# Altium schematic sheet ip_phone_g_codec.SchDoc: CODEC
size A3; Organization: Instituto Atlântico; Address1: Rua Chico Lemos, 946; Address2: Cidade dos Funcionários; Address3: CEP: 60822-780; Address4: Fortaleza - CE
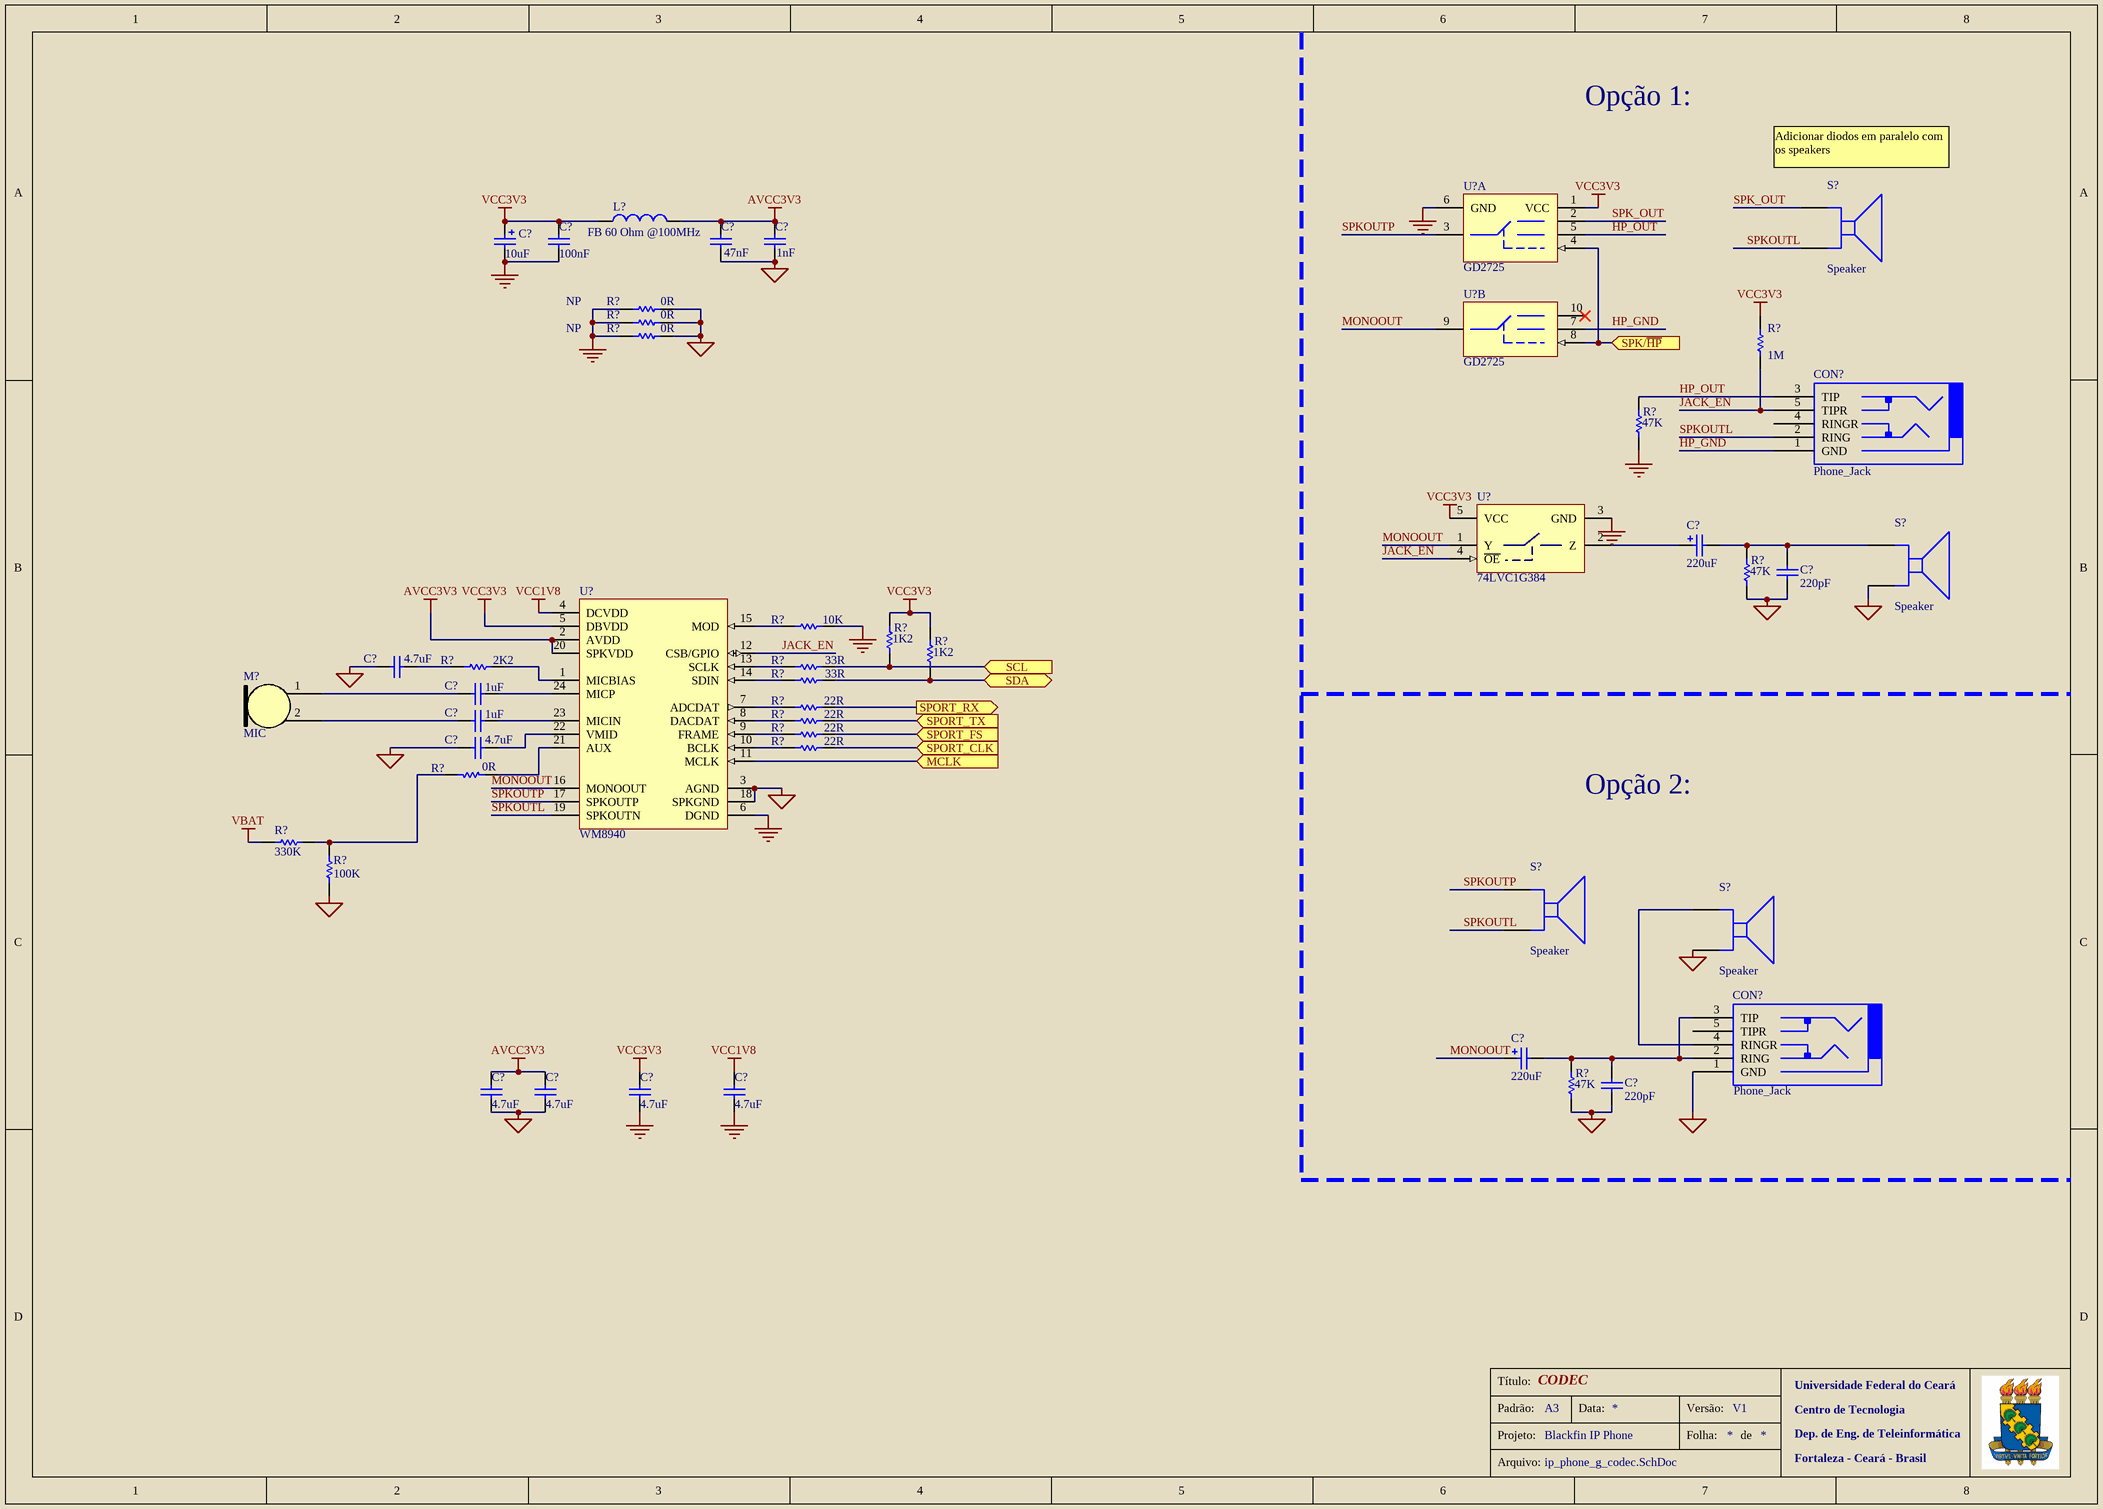
[diagram p0: ip_phone_g_codec.SchDoc]

## Parts
(Parts that share a designator on the sheet are numbered #1, #2 ... from top to bottom, then left to right.)
C?#1  10uF  [VE-100M0JTR-0305]
C?#2  100nF  [CC1005-0402]
C?#3  47nF  [CC1005-0402]
C?#4  1nF  [CC1005-0402]
C?#5  220uF
C?#6  220pF  [CC1005-0402]
C?#7  4.7uF  [CC1608-0603]
C?#8  1uF  [CC1005-0402]
C?#9  1uF  [CC1005-0402]
C?#10  4.7uF
C?#11  220uF
C?#12  220pF  [CC1005-0402]
C?#13  4.7uF  [CC1608-0603]
C?#14  4.7uF  [CC1608-0603]
C?#15  4.7uF  [CC1608-0603]
C?#16  4.7uF  [CC1608-0603]
CON?#1  Phone_Jack  [Phone_Jack]
CON?#2  Phone_Jack  [Phone_Jack]
L?  FB 60 Ohm @100MHz  [INDUTOR_0603]
M?  MIC  [MIC]
R?#1  0R  [CR1608-0603]
R?#2  1M  [CR1005-0402]
R?#3  0R  [CR1608-0603]
R?#4  0R  [CR1608-0603]
R?#5  47K  [CR1005-0402]
R?#6  47K  [CR1005-0402]
R?#7  1K2  [CR1005-0402]
R?#8  10K  [CR1005-0402]
R?#9  1K2  [CR1005-0402]
R?#10  2K2  [CR1005-0402]
R?#11  33R  [CR1005-0402]
R?#12  33R  [CR1005-0402]
R?#13  22R  [CR1005-0402]
R?#14  22R  [CR1005-0402]
R?#15  22R  [CR1005-0402]
R?#16  22R  [CR1005-0402]
R?#17  0R  [CR1005-0402]
R?#18  330K  [CR1005-0402]
R?#19  100K  [CR1005-0402]
R?#20  47K  [CR1005-0402]
S?#1  Speaker  [Speaker]
S?#2  Speaker  [Speaker]
S?#3  Speaker  [Speaker]
S?#4  Speaker  [Speaker]
U?#1  GD2725  [QFN10]  (part A of 2)
U?#2  GD2725  [QFN10]  (part B of 2)
U?#3  74LVC1G384  [SOT753]
U?#4  WM8940  [QFN24]

## Ports
MCLK (in), SCL (in), SDA (bidir), SPK/~{HP} (in), SPORT_CLK (in), SPORT_FS (in), SPORT_RX (out), SPORT_TX (in)

## Nets
AGND: C?#3.1 C?#4.1 C?#6.1 C?#7.2 C?#10.2 C?#12.1 C?#13.1 C?#14.1 CON?#2.1(GND) R?#1.1 R?#3.1 R?#4.1 R?#6.2 R?#19.1 R?#20.2 S?#2.1(CKT1) S?#4.1(CKT1) U?#4.3(AGND) U?#4.18(SPKGND)
AVCC3V3: C?#3.2 C?#4.2 C?#13.2 C?#14.2 L?.2 U?#4.2(AVDD) U?#4.20(SPKVDD)
GND: C?#1.2 C?#2.1 C?#15.1 C?#16.1 R?#1.2 R?#3.2 R?#4.2 R?#5.2 R?#8.2 U?#1.6(GND) U?#3.3(GND) U?#4.6(DGND)
VBAT: R?#18.1
VCC1V8: C?#16.2 U?#4.4(DCVDD)
VCC3V3: C?#1.1 C?#2.2 C?#15.2 L?.1 R?#2.1 R?#7.1 R?#9.1 U?#1.1(VCC) U?#3.5(VCC) U?#4.5(DBVDD)
HP_GND: CON?#1.1(GND) U?#2.7(NC2)
HP_OUT: CON?#1.3(TIP) R?#5.1 U?#1.5(NC1)
JACK_EN: CON?#1.5(TIPR) R?#2.2 U?#3.4(~{OE}) U?#4.12(CSB/GPIO)
MCLK: U?#4.11(MCLK) ; port MCLK
MONOOUT: C?#11.1 U?#2.9(COM2) U?#3.1(Y) U?#4.16(MONOOUT)
SCL: R?#7.2 R?#11.2 ; port SCL
SDA: R?#9.2 R?#12.2 ; port SDA
SPK/~{HP}: U?#1.4(IN1) U?#2.8(IN2) ; port SPK/~{HP}
SPK_OUT: S?#1.2(CKT2) U?#1.2(NO1)
SPKOUTL: CON?#1.2(RING) S?#1.1(CKT1) S?#3.1(CKT1) U?#4.19(SPKOUTN)
SPKOUTP: S?#3.2(CKT2) U?#1.3(COM1) U?#4.17(SPKOUTP)
SPORT_CLK: R?#16.2 ; port SPORT_CLK
SPORT_FS: R?#15.2 ; port SPORT_FS
SPORT_RX: R?#13.2 ; port SPORT_RX
SPORT_TX: R?#14.2 ; port SPORT_TX
NetC?#5_1: C?#5.1 U?#3.2(Z)
NetC?#5_2: C?#5.2 C?#6.2 R?#6.1 S?#2.2(CKT2)
NetC?#7_1: C?#7.1 R?#10.1
NetC?#8_1: C?#8.1 U?#4.24(MICP)
NetC?#8_2: C?#8.2 M?.1(OUT)
NetC?#9_1: C?#9.1 U?#4.23(MICIN)
NetC?#9_2: C?#9.2 M?.2(GND)
NetC?#10_1: C?#10.1 U?#4.22(VMID)
NetC?#11_2: C?#11.2 C?#12.2 CON?#2.2(RING) CON?#2.3(TIP) R?#20.1
NetCON?#2_4: CON?#2.4(RINGR) S?#4.2(CKT2)
NetR?#8_1: R?#8.1 U?#4.15(MOD)
NetR?#10_2: R?#10.2 U?#4.1(MICBIAS)
NetR?#11_1: R?#11.1 U?#4.13(SCLK)
NetR?#12_1: R?#12.1 U?#4.14(SDIN)
NetR?#13_1: R?#13.1 U?#4.7(ADCDAT)
NetR?#14_1: R?#14.1 U?#4.8(DACDAT)
NetR?#15_1: R?#15.1 U?#4.9(FRAME)
NetR?#16_1: R?#16.1 U?#4.10(BCLK)
NetR?#17_1: R?#17.1 U?#4.21(AUX)
NetR?#17_2: R?#17.2 R?#18.2 R?#19.2

Not connected (* = marked no-connect by the designer): CON?#1 4(RINGR); CON?#2 5(TIPR); U?#2 10(NO2)*

## Notes on the sheet
- Opção 1:
- (near S?#1) Adicionar diodos em paralelo com os speakers
- Opção 2:
- Título:
- Universidade Federal do Ceará
- Padrão:
- Projeto:
- A3
- Blackfin IP Phone
- Data:
- Versão:
- Folha:
- V1
- de
- Centro de Tecnologia
- Dep. de Eng. de Teleinformática
- Fortaleza - Ceará - Brasil
- Arquivo:

## Library data of the parts
C?#1 = Capacitor_Electrolytic: Aluminum Electrolytic Capacitors - SMD 6.3 Volts 10uF 20%; eVendorPart#: 140-VE100M0JTR0305; Manufacturer: Lelon; eVendor: Mouser; MSRP: 0,099; eVendorPrice: 0,18; Part#: VE-100M0JTR-0305; MOQ: 1000
C?#2 = Capacitor: MLCC - SMD/SMT 100nF 16V 10% 0402; eVendorPart#: 810-C1005X7R1C104K; Manufacturer: TDK; Part#: C1005X7R1C104KT; eVendor: Mouser; eVendorPrice: 0,03; MSRP: 0,005; MOQ: 1000
C?#3 = Capacitor: MLCC - SMD/SMT 47nF 16V 10% 0402; eVendorPart#: 311-1334-1-ND; Manufacturer: Yageo; Part#: CC0402KRX7R6BB473; eVendor: Digikey; eVendorPrice: 0,02; MSRP: 0,00429; MOQ: 1000
C?#4 = Capacitor: MLCC - SMD/SMT 1nF 16V 10% 0402; eVendorPart#: 311-1352-1-ND; Manufacturer: Yageo; Part#: CC0402KRX7R7BB102; eVendor: Digikey; eVendorPrice: 0,015; MSRP: 0,00335; MOQ: 1000
C?#5 C?#11 = Capacitor_Electrolytic: Aluminum Electrolytic Capacitors - SMD 6.3 Volts 220uF 20%; eVendorPart#: 140-VE221M0JTR0605; Part#: VE-221M0JTR-0605; Manufacturer: Lelon; eVendor: Mouser; MSRP: 0,07; eVendorPrice: 0,16; MOQ: 1000
C?#6 C?#12 = Capacitor: Capacitor 220pF 0402; eVendorPart#: 311-1035-1-ND; Manufacturer: Yageo; Part#: CC0402KRX7R9BB221; eVendor: Digikey; eVendorPrice: 0,015; MSRP: 0,00335; MOQ: 1000
C?#7 C?#10 C?#13-C?#16 = Capacitor: MLCC - SMD/SMT 4.7uF 6.3V 10% 0603; eVendorPart#: 810-C1608X5R0J475K; Manufacturer: TDK; Part#: C1608X5R0J475KT; eVendor: Mouser; eVendorPrice: 0,09; MSRP: 0,031; MOQ: 1000
C?#8 C?#9 = Capacitor: CAP CER 1.0UF 6.3V 20% X5R 0402; eVendorPart#: 490-1319-1-ND; Manufacturer: Murata Electronics North America; Part#: GRM155R60J105ME19D; eVendor: Digikey; eVendorPrice: 0,055; MSRP: 0,01193; MOQ: 1000
CON?#1 CON?#2 = Phone_Jack: CONN JACK STEREO 5PIN 2.5MM SMD; eVendorPart#: CP1-2535SJCT-ND; Manufacturer: CUI Inc; Part#: SJ1-2535-SMT; eVendorPrice: 1,51; eVendor: Digikey; MSRP: 0,71676; MOQ: 500
L? = Inductor: Ferrite Bead 60 Ohm @100MHz; eVendorPart#: 667-EXC-3BP600H; Manufacturer: Panasonic Electronic Components; Part#: EXC-3BP600H; eVendor: Mouser; eVendorPrice: 0,11; MSRP: 0,066; MOQ: 1000
M? = MIC: Microphones -44DB 2VDC .5MA 2.2KOHM; Part#: POW-1644P-B-R; Manufacturer: PUI Audio; eVendorPart#: 665-POW1644PBR; eVendor: Mouser; eVendorPrice: 2,95; MSRP: 2,24; MOQ: 100
R?#1 R?#3 R?#4 = Resistor: Thick Film Resistors ZERO OHM; eVendorPart#: 652-CR0603-J/-000ELF; Manufacturer: Bourns; Part#: CR0603-J/-000ELF; eVendor: Mouser; eVendorPrice: 0,02; MSRP: 0,008; MOQ: 1000
  R?#1 R?#4: NP: NP
R?#2 = Resistor: Thick Film Resistors SMD 0402 47K 5%  1/16 W
R?#5 R?#6 R?#20 = Resistor: Thick Film Resistors SMD 0402 47K 5%  1/16 W; eVendorPart#: 311-47KJRCT-ND; Manufacturer: Yageo; Part#: RC0402JR-0747KL; eVendor: Digikey; eVendorPrice: 0,012; MSRP: 0,00253; MOQ: 1000
R?#7 R?#9 = Resistor: Thick Film Resistors SMD 0402 1K2 5%  1/16 W; eVendorPart#: 311-1.2KJRCT-ND; Manufacturer: Yageo; Part#: RC0402JR-071K2L; eVendor: Digikey; eVendorPrice: 0,012; MSRP: 0,00253; MOQ: 1000
R?#8 = Resistor: Thick Film Resistors SMD 0402 10K 5%  1/16 W; eVendorPart#: 311-10KJRCT-ND; Manufacturer: Yageo; Part#: RC0402JR-0710KL; eVendor: Digikey; eVendorPrice: 0,012; MSRP: 0,00253; MOQ: 1000
R?#10 = Resistor: Thick Film Resistors SMD 0402 2K2 5%  1/16 W; eVendorPart#: 311-2.2KJRCT-ND; Manufacturer: Yageo; Part#: RC0402JR-072K2L; eVendor: Digikey; eVendorPrice: 0,012; MSRP: 0,00253; MOQ: 1000
R?#11 R?#12 = Resistor: Thick Film Resistors SMD 0402 33R 5%  1/16 W; eVendorPart#: 311-33JRCT-ND; Manufacturer: Yageo; Part#: RC0402JR-0733RL; eVendor: Digikey; eVendorPrice: 0,012; MSRP: 0,00253; MOQ: 1000
R?#13-R?#16 = Resistor: Thick Film Resistors SMD 0402 22R 5%  1/16 W; eVendorPart#: 71-CRCW0402J-22-E3; Manufacturer: Vishay/Dale; Part#: CRCW040222R0JNED; eVendor: Mouser; eVendorPrice: 0,08; MSRP: 0,015; MOQ: 1000
R?#17 = Resistor: Thick Film Resistors 0402 1/16W Jumper; eVendorPart#: 667-ERJ-2GE0R00X; Manufacturer: Panasonic Electronic Components; Part#: ERJ-2GE0R00X; eVendor: Mouser; eVendorPrice: 0,05; MSRP: 0,004; MOQ: 1000
R?#18 = Resistor: Thick Film Resistor 330K 1% 1/16W; eVendorPart#: RMCF0402FT330KCT-ND; Manufacturer: Stackpole Electronics Inc; Part#: RMCF0402FT330K; eVendor: Digikey; eVendorPrice: 0,04; MSRP: 0,00384; MOQ: 1000
R?#19 = Resistor: Thick Film Resistor 100K 1% 1/16W; eVendorPart#: 311-100KLRCT-ND; Manufacturer: Yageo; Part#: RC0402FR-07100KL; eVendor: Digikey; eVendorPrice: 0,014; MSRP: 0,00288; MOQ: 1000
U?#1 U?#2 = DG2725: Dual SPDT Analog Switch; eVendorPart#: 781-DG2725DN-T1-GE4; Part#: DG2725DN-T1-GE4; Manufacturer: Vishay/Siliconix; eVendor: Mouser; eVendorPrice: 0,69; MSRP: 0,30; MOQ: 1000
U?#3 = 74LVC1G384: Low Voltage SPST Analog Switch; eVendorPart#: 771-LVC1G384GV125; Part#: 74LVC1G384GV,125; Manufacturer: NXP Semiconductors; eVendor: Mouser; eVendorPrice: 0,07; MSRP: 0,046; MOQ: 1000
U?#4 = WM8940: Mono Audio CODEC; Part#: WM8940GEFL/V; Manufacturer: Wolfson Microelectronics; eVendor: Mouser; eVendorPrice: 2,82; eVendorPatr#: 238-WM8940GEFL/V; MSRP: 1,70; MOQ: 1000
S?#1-S?#4 = Speaker: eVendor: *; eVendorPart#: *; Part#: *; eVendorPrice: *; MOQ: *; MSRP: *; Manufacturer: *